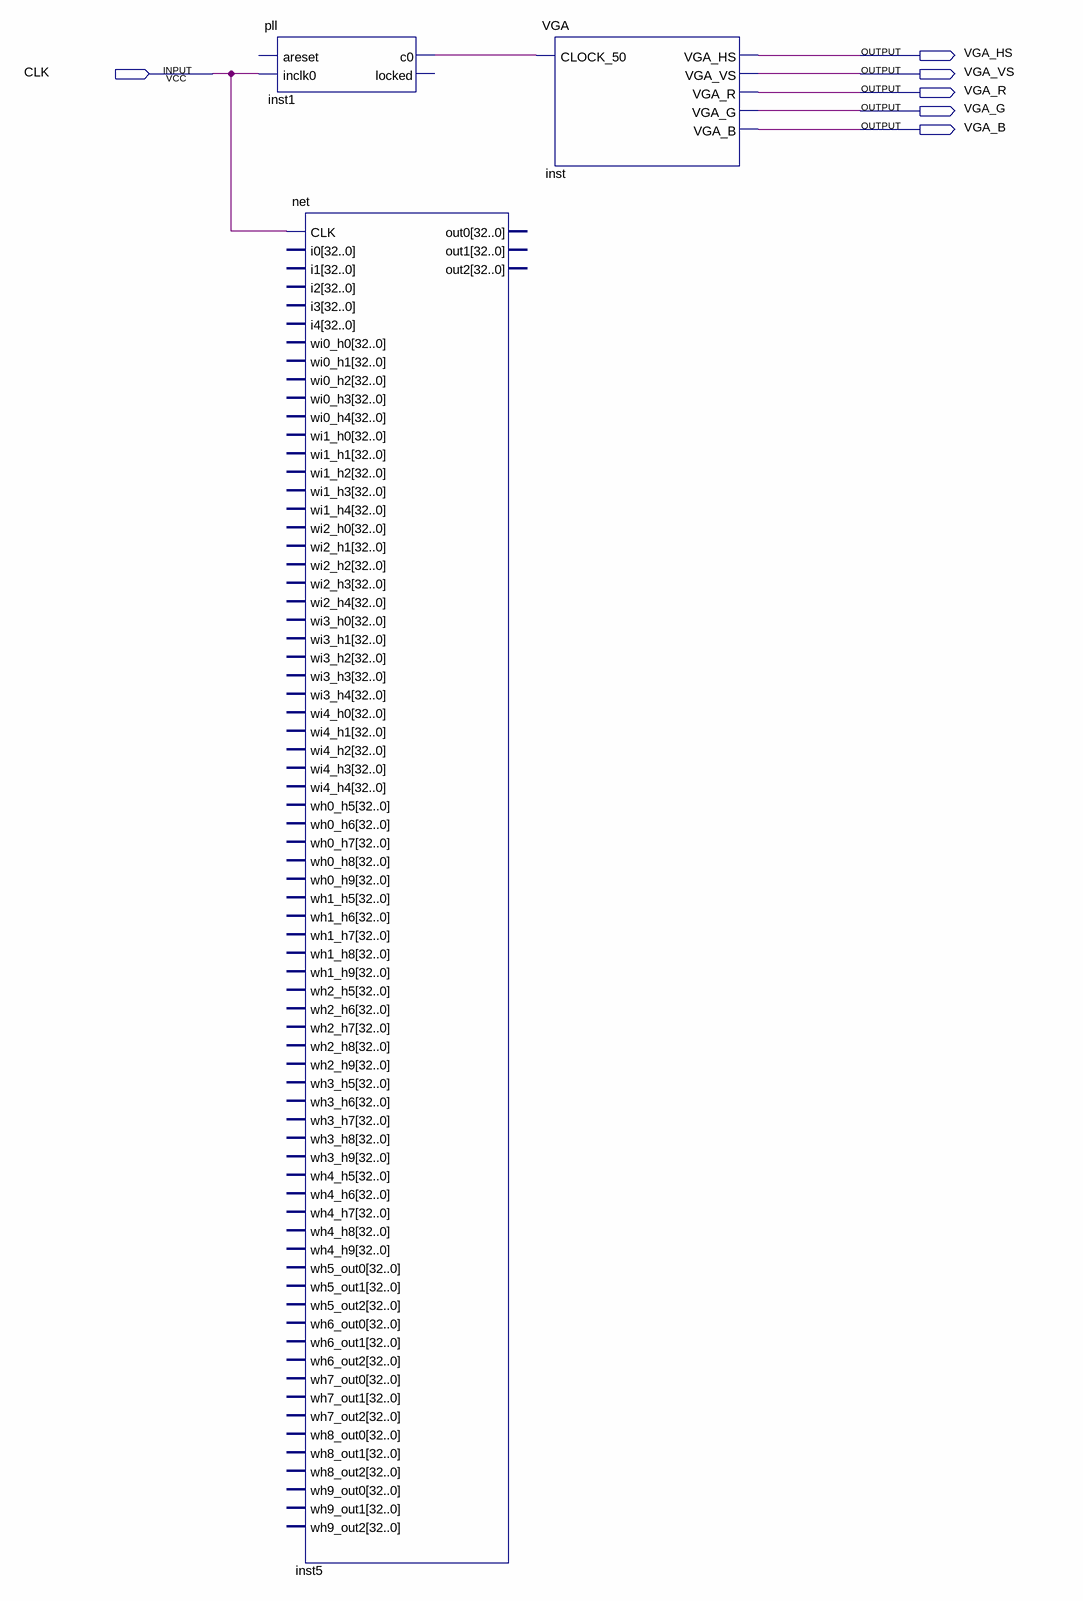
[diagram p0: schematic sheet]
// Quartus schematic fpgabrain.bdf as structural Verilog: 3 symbols, 6 pins
module fpgabrain (
  input  CLK,
  output VGA_HS,
  output VGA_VS,
  output VGA_R,
  output VGA_G,
  output VGA_B
);

  wire inst1_c0;

  pll inst1 (.inclk0(CLK), .c0(inst1_c0));  // open: areset, locked
  net inst5 (.CLK(CLK));  // open: i0, i1, i2, i3, i4, wi0_h0, wi0_h1, wi0_h2, wi0_h3, wi0_h4, wi1_h0, wi1_h1, wi1_h2, wi1_h3, wi1_h4, wi2_h0, wi2_h1, wi2_h2, wi2_h3, wi2_h4, wi3_h0, wi3_h1, wi3_h2, wi3_h3, wi3_h4, wi4_h0, wi4_h1, wi4_h2, wi4_h3, wi4_h4, wh0_h5, wh0_h6, wh0_h7, wh0_h8, wh0_h9, wh1_h5, wh1_h6, wh1_h7, wh1_h8, wh1_h9, wh2_h5, wh2_h6, wh2_h7, wh2_h8, wh2_h9, wh3_h5, wh3_h6, wh3_h7, wh3_h8, wh3_h9, wh4_h5, wh4_h6, wh4_h7, wh4_h8, wh4_h9, wh5_out0, wh5_out1, wh5_out2, wh6_out0, wh6_out1, wh6_out2, wh7_out0, wh7_out1, wh7_out2, wh8_out0, wh8_out1, wh8_out2, wh9_out0, wh9_out1, wh9_out2, out0, out1, out2
  VGA inst (.CLOCK_50(inst1_c0), .VGA_HS(VGA_HS), .VGA_VS(VGA_VS), .VGA_R(VGA_R), .VGA_G(VGA_G), .VGA_B(VGA_B));
endmodule
